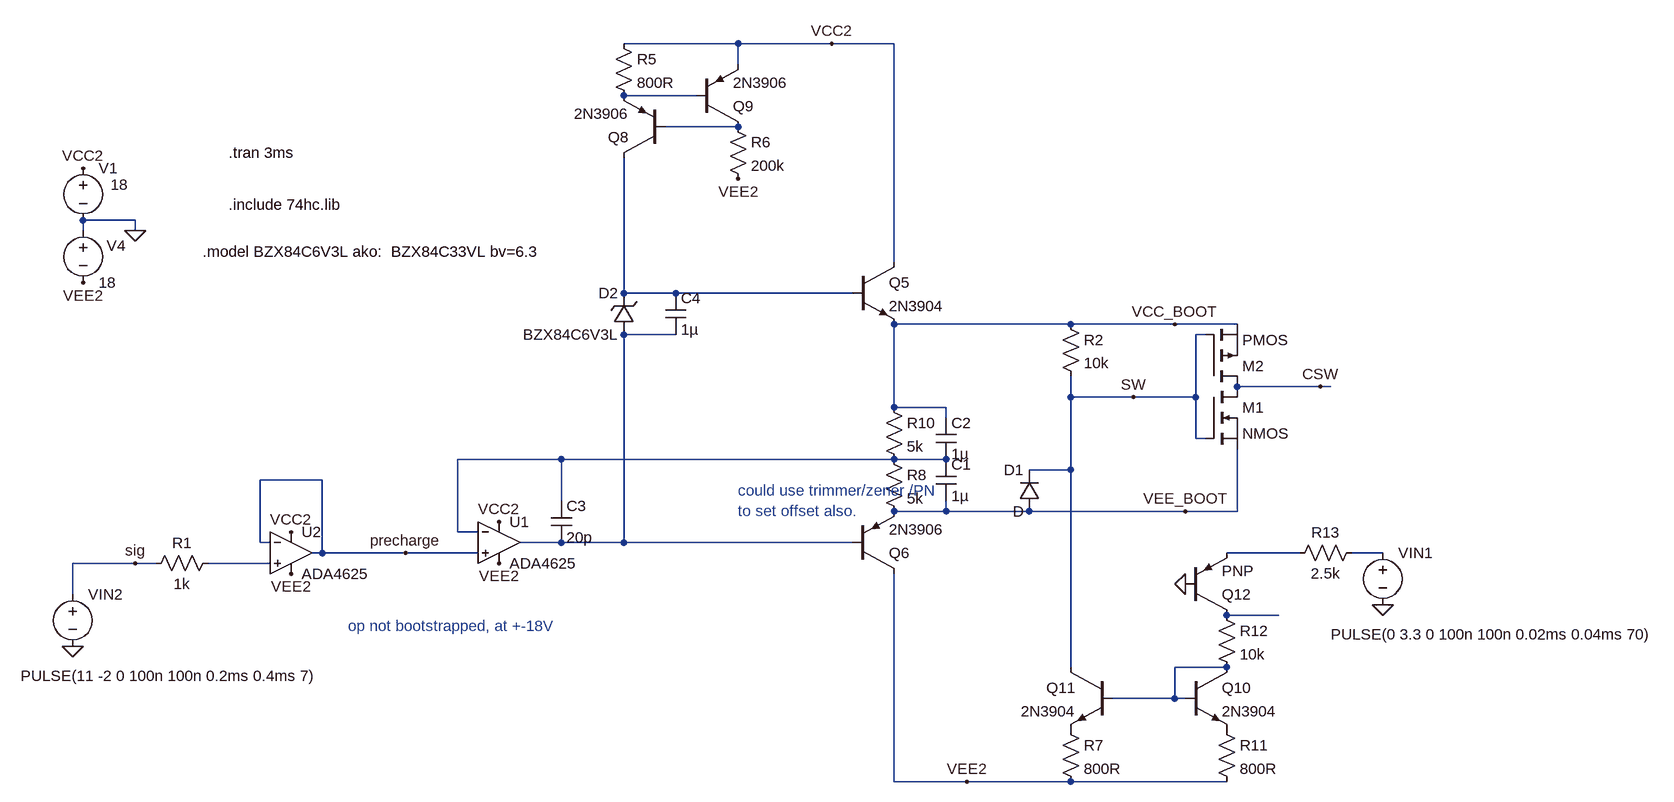
[diagram p0: schematic Draft56.asc]
Draft56.asc, the LTspice schematic file:
Version 4
SHEET 1 2756 1020
WIRE 880 -288 704 -288
WIRE 1024 -288 880 -288
WIRE 1120 -288 1024 -288
WIRE 880 -256 880 -288
WIRE 816 -208 704 -208
WIRE 880 -160 768 -160
WIRE -48 -16 -128 -16
WIRE -128 0 -128 -16
WIRE -48 0 -48 -16
WIRE 1120 48 1120 -288
WIRE 704 96 704 -112
WIRE 784 96 704 96
WIRE 1056 96 784 96
WIRE 1392 144 1120 144
WIRE 1552 144 1392 144
WIRE 1648 144 1552 144
WIRE 784 160 704 160
WIRE 1600 160 1584 160
WIRE 1776 240 1648 240
WIRE 1792 240 1776 240
WIRE 1392 256 1392 224
WIRE 1488 256 1392 256
WIRE 1584 256 1584 160
WIRE 1584 256 1488 256
WIRE 1120 272 1120 144
WIRE 1200 272 1120 272
WIRE 1200 288 1200 272
WIRE 1584 320 1584 256
WIRE 1600 320 1584 320
WIRE 608 352 448 352
WIRE 1120 352 608 352
WIRE 1200 352 1120 352
WIRE 1392 368 1392 256
WIRE 1392 368 1328 368
WIRE 240 384 144 384
WIRE 608 416 608 352
WIRE 1200 432 1200 416
WIRE 1200 432 1120 432
WIRE 1328 432 1200 432
WIRE 1568 432 1328 432
WIRE 1648 432 1648 336
WIRE 1648 432 1568 432
WIRE 448 464 448 352
WIRE 480 464 448 464
WIRE 144 480 144 384
WIRE 160 480 144 480
WIRE 608 480 544 480
WIRE 704 480 704 160
WIRE 704 480 608 480
WIRE 1056 480 704 480
WIRE 240 496 240 384
WIRE 240 496 224 496
WIRE 368 496 240 496
WIRE 480 496 368 496
WIRE 1744 496 1632 496
WIRE 1872 496 1824 496
WIRE -48 512 -144 512
WIRE -16 512 -48 512
WIRE 160 512 64 512
WIRE -144 560 -144 512
WIRE 1712 592 1632 592
WIRE 1392 672 1392 368
WIRE 1632 672 1552 672
WIRE 1552 720 1552 672
WIRE 1552 720 1456 720
WIRE 1568 720 1552 720
WIRE 1120 848 1120 528
WIRE 1232 848 1120 848
WIRE 1392 848 1232 848
WIRE 1632 848 1392 848
FLAG -48 0 0
FLAG -128 -96 VCC2
FLAG -128 80 VEE2
FLAG 880 -80 VEE2
FLAG -144 640 0
FLAG 1552 144 VCC_BOOT
FLAG 1568 432 VEE_BOOT
FLAG 1024 -288 VCC2
FLAG 1488 256 SW
FLAG 1872 576 0
FLAG 1568 544 0
FLAG 512 448 VCC2
FLAG 512 512 VEE2
FLAG 192 464 VCC2
FLAG 192 528 VEE2
FLAG 368 496 precharge
FLAG -48 512 sig
FLAG 1232 848 VEE2
FLAG 1776 240 CSW
SYMBOL voltage -128 -112 R0
WINDOW 123 0 0 Left 0
WINDOW 39 0 0 Left 0
WINDOW 3 42 41 Left 2
SYMATTR Value 18
SYMATTR InstName V1
SYMBOL voltage -128 -16 R0
WINDOW 123 0 0 Left 0
WINDOW 39 0 0 Left 0
WINDOW 0 36 39 Left 2
SYMATTR InstName V4
SYMATTR Value 18
SYMBOL npn 1056 48 R0
SYMATTR InstName Q5
SYMATTR Value 2N3904
SYMBOL pnp 1056 528 M180
SYMATTR InstName Q6
SYMATTR Value 2N3906
SYMBOL voltage -144 544 R0
WINDOW 123 0 0 Left 0
WINDOW 39 0 0 Left 0
WINDOW 3 -80 141 Left 2
SYMATTR Value PULSE(11 -2 0 100n 100n 0.2ms 0.4ms 7)
SYMATTR InstName VIN2
SYMBOL res 80 496 R90
WINDOW 0 0 56 VBottom 2
WINDOW 3 32 56 VTop 2
SYMATTR InstName R1
SYMATTR Value 1k
SYMBOL cap 768 96 R0
SYMATTR InstName C4
SYMATTR Value 1µ
SYMBOL zener 720 160 R180
WINDOW 0 24 64 Left 2
WINDOW 3 24 0 Left 2
SYMATTR InstName D2
SYMATTR Value BZX84C6V3L
SYMBOL pnp 768 -112 R180
SYMATTR InstName Q8
SYMATTR Value 2N3906
SYMBOL pnp 816 -160 M180
SYMATTR InstName Q9
SYMATTR Value 2N3906
SYMBOL res 688 -304 R0
SYMATTR InstName R5
SYMATTR Value 800R
SYMBOL res 864 -176 R0
SYMATTR InstName R6
SYMATTR Value 200k
SYMBOL res 1104 336 R0
SYMATTR InstName R8
SYMATTR Value 5k
SYMBOL res 1104 256 R0
SYMATTR InstName R10
SYMATTR Value 5k
SYMBOL res 1376 128 R0
SYMATTR InstName R2
SYMATTR Value 10k
SYMBOL diode 1344 432 R180
WINDOW 0 24 64 Left 2
WINDOW 3 24 0 Left 2
SYMATTR InstName D1
SYMBOL npn 1568 672 R0
SYMATTR InstName Q10
SYMATTR Value 2N3904
SYMBOL npn 1456 672 M0
SYMATTR InstName Q11
SYMATTR Value 2N3904
SYMBOL res 1376 752 R0
SYMATTR InstName R7
SYMATTR Value 800R
SYMBOL res 1616 752 R0
SYMATTR InstName R11
SYMATTR Value 800R
SYMBOL voltage 1872 480 R0
WINDOW 123 0 0 Left 0
WINDOW 39 0 0 Left 0
WINDOW 3 -80 141 Left 2
SYMATTR Value PULSE(0 3.3 0 100n 100n 0.02ms 0.04ms 70)
SYMATTR InstName VIN1
SYMBOL res 1616 576 R0
SYMATTR InstName R12
SYMATTR Value 10k
SYMBOL pnp 1568 592 M180
SYMATTR InstName Q12
SYMBOL res 1840 480 R90
WINDOW 0 0 56 VBottom 2
WINDOW 3 32 56 VTop 2
SYMATTR InstName R13
SYMATTR Value 2.5k
SYMBOL OpAmps\\ADA4625 512 416 R0
SYMATTR InstName U1
SYMBOL cap 1184 352 R0
SYMATTR InstName C1
SYMATTR Value 1µ
SYMBOL cap 1184 288 R0
SYMATTR InstName C2
SYMATTR Value 1µ
SYMBOL OpAmps\\ADA4625 192 432 R0
SYMATTR InstName U2
SYMBOL nmos 1600 240 R0
SYMATTR InstName M1
SYMBOL pmos 1600 240 M180
SYMATTR InstName M2
SYMBOL cap 592 416 R0
SYMATTR InstName C3
SYMATTR Value 20p
TEXT 96 -120 Left 2 !.tran 3ms
TEXT 56 32 Left 2 !.model BZX84C6V3L ako:  BZX84C33VL bv=6.3
TEXT 280 608 Left 2 ;op not bootstrapped, at +-18V
TEXT 96 -40 Left 2 !.include 74hc.lib
TEXT 880 400 Left 2 ;could use trimmer/zener /PN \nto set offset also.

The netlist it stands for:
* Draft56.asc
V1 VCC2 0 18
V4 0 VEE2 18
Q5 VCC2 N003 VCC_BOOT 0 2N3904
Q6 VEE2 N004 VEE_BOOT 0 2N3906
VIN2 sig 0 PULSE(11 -2 0 100n 100n 0.2ms 0.4ms 7)
R1 N008 sig 1k
C4 N003 N004 1µ
D2 N004 N003 BZX84C6V3L
Q8 N003 N002 N001 0 2N3906
Q9 N002 N001 VCC2 0 2N3906
R5 VCC2 N001 800R
R6 N002 VEE2 200k
R8 N005 VEE_BOOT 5k
R10 VCC_BOOT N005 5k
R2 VCC_BOOT SW 10k
D1 VEE_BOOT SW D
Q10 N010 N010 P001 0 2N3904
Q11 SW N010 P002 0 2N3904
R7 P002 VEE2 800R
R11 P001 VEE2 800R
VIN1 N007 0 PULSE(0 3.3 0 100n 100n 0.02ms 0.04ms 70)
R12 N009 N010 10k
Q12 N009 0 N006 0 PNP
R13 N007 N006 2.5k
XU1 precharge N005 VCC2 VEE2 N004 ADA4625  ; pins In+ In- V+ V- OUT
C1 N005 VEE_BOOT 1µ
C2 VCC_BOOT N005 1µ
XU2 N008 precharge VCC2 VEE2 precharge ADA4625  ; pins In+ In- V+ V- OUT
M1 CSW SW VEE_BOOT VEE_BOOT NMOS
M2 CSW SW VCC_BOOT VCC_BOOT PMOS
C3 N005 N004 20p
.model D D
.lib standard.dio
.model NPN NPN
.model PNP PNP
.lib standard.bjt
.model NMOS NMOS
.model PMOS PMOS
.lib standard.mos
.tran 3ms
.model BZX84C6V3L ako:  BZX84C33VL bv=6.3
* op not bootstrapped, at +-18V
.include 74hc.lib
* could use trimmer/zener /PN
* to set offset also.
.backanno
.end